# Altium schematic sheet PortSplitters.SchDoc: Port splitter Weather Station
size A; Organization: Altium Limited; Address1: L3, 12a Rodborough Rd; Address2: Frenchs Forest; Address3: NSW; Address4: Australia 2086; DocumentNumber: 2; SheetNumber: 2; SheetTotal: 2
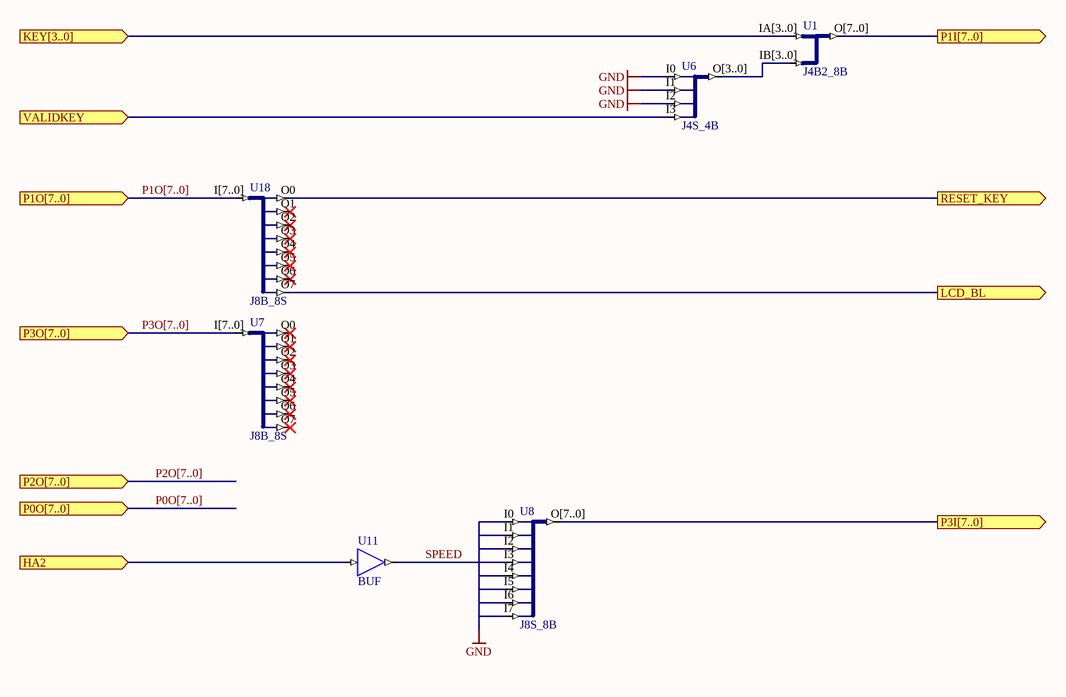
[diagram p0: PortSplitters.SchDoc]

## Parts
U1  J4B2_8B
U6  J4S_4B
U7  J8B_8S
U8  J8S_8B
U11  BUF
U18  J8B_8S

## Ports
HA2 (in), KEY[3..0] (in), LCD_BL (out), P0O[7..0] (in), P1I[7..0] (out), P1O[7..0] (in), P2O[7..0] (in), P3I[7..0] (out), P3O[7..0] (in), RESET_KEY (out), VALIDKEY (in)

## Nets
GND: U6.I0 U6.I1 U6.I2 U8.I0 U8.I1 U8.I2 U8.I4 U8.I5 U8.I6 U8.I7
HA2: U11.I ; port HA2
KEY[3..0]: U1.IA[3..0] ; port KEY[3..0]
LCD_BL: U18.O7 ; port LCD_BL
P1I[7..0]: U1.O[7..0] ; port P1I[7..0]
P1O[7..0]: U18.I[7..0] ; port P1O[7..0]
P3I[7..0]: U8.O[7..0] ; port P3I[7..0]
P3O[7..0]: U7.I[7..0] ; port P3O[7..0]
RESET_KEY: U18.O0 ; port RESET_KEY
SPEED: U8.I3 U11.O
VALIDKEY: U6.I3 ; port VALIDKEY
NetU1_IB[3..0]: U1.IB[3..0] U6.O[3..0]

Not connected (* = marked no-connect by the designer): U7 O0* O1* O2* O3* O4* O5* O6* O7*; U18 O1* O2* O3* O4* O5* O6*

## Buses and harness runs
bus P0O[7..0] = port P0O[7..0]
bus P1O[7..0] = port P1O[7..0]
bus P2O[7..0] = port P2O[7..0]
bus P3O[7..0] = port P3O[7..0]

## Notes on the sheet
- Title
- Size:
- Date:
- A
- Number:
- Time:
- Revision:
- Sheet
- of
- File:

## Library data of the parts
U1 = J4B2_8B: 2 x 4-Bit input bus to 1 x 8-bit output bus; ArchiveName: GENERIC; Published: 18-Dec-2003; Publisher: Altium Limited; Core Revision: 1.00.00
U6 = J4S_4B: 4 Single pin inputs to single 4-Bit output bus; ArchiveName: GENERIC; Published: 18-Dec-2003; Publisher: Altium Limited; Core Revision: 1.00.00
U7 U18 = J8B_8S: 8-Bit input bus to 8 single pin outputs; ArchiveName: GENERIC; Published: 18-Dec-2003; Publisher: Altium Limited; Core Revision: 1.00.00
U8 = J8S_8B: 8 Single pin inputs to single 8-Bit output bus; ArchiveName: GENERIC; Published: 18-Dec-2003; Publisher: Altium Limited; Core Revision: 1.00.00
U11 = BUF: 1-bit General Purpose (Non-inverting) Buffer; ArchiveName: GENERIC; Published: 18-Dec-2003; Publisher: Altium Limited; Xilinx Equivalent: BUF; Core Revision: 1.00.00